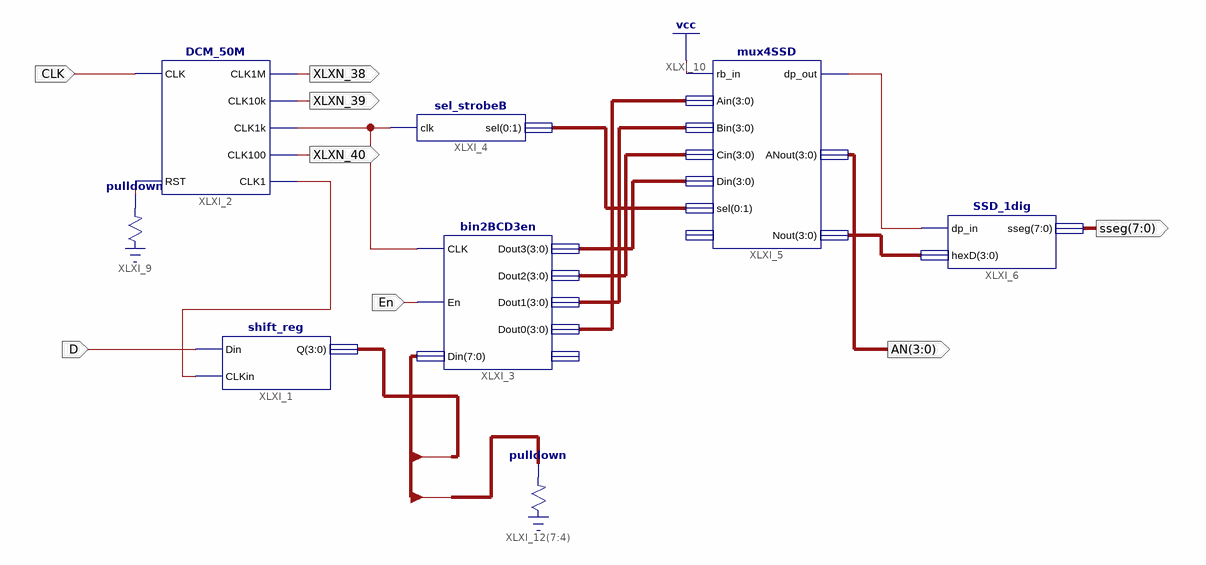
[diagram p0: schematic sheet 1]
// Xilinx ISE schematic L7exp6.sch (spartan3e) as structural Verilog: 8 symbols, 8 ports
module L7exp6 (
  input  CLK,
  input  D,
  input  En,
  output [3:0] AN,
  output [7:0] sseg,
  output XLXN_38,
  output XLXN_39,
  output XLXN_40
);

  wire CLKin, XLXN_18, XLXN_29, XLXN_31;
  wire [1:0] XLXN_9;
  wire [3:0] XLXN_21, XLXN_52, XLXN_53, XLXN_54, XLXN_55;
  wire [7:0] Din;

  shift_reg XLXI_1 (.Din(D), .CLKin(CLKin), .Q(Din[3:0]));
  DCM_50M XLXI_2 (
    .CLK(CLK), .RST(XLXN_31), .CLK1M(XLXN_38), .CLK10k(XLXN_39), .CLK1k(XLXN_29), .CLK100(XLXN_40),
    .CLK1(CLKin));
  bin2BCD3en XLXI_3 (
    .CLK(XLXN_29), .En(En), .Din(Din), .Dout3(XLXN_52), .Dout2(XLXN_53), .Dout1(XLXN_54), .Dout0(XLXN_55));  // open: RBout
  sel_strobeB XLXI_4 (.clk(XLXN_29), .sel({XLXN_9[0], XLXN_9[1]}));
  mux4SSD XLXI_5 (
    .rb_in(1'b1), .Ain(XLXN_55), .Bin(XLXN_54), .Cin(XLXN_53), .Din(XLXN_52), .sel({XLXN_9[0], XLXN_9[1]}),
    .dp_out(XLXN_18), .ANout(AN), .Nout(XLXN_21));  // open: dp_in
  SSD_1dig XLXI_6 (.dp_in(XLXN_18), .hexD(XLXN_21), .sseg(sseg));
  \pulldown  XLXI_9 (.O(XLXN_31));
  \pulldown  XLXI_12[7:4] (.O(Din[7:4]));
endmodule
